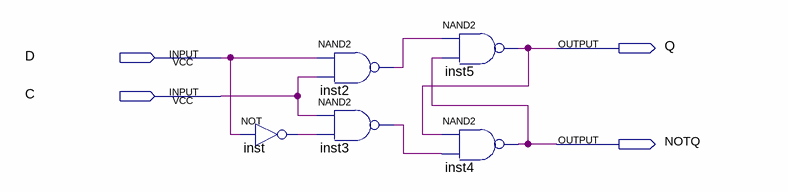
[diagram p0: schematic sheet]
// Quartus schematic DFlip.bdf as structural Verilog: 5 symbols, 4 pins
module DFlip (
  input  D,
  input  C,
  output Q,
  output NOTQ
);

  wire inst2_out, inst3_out, inst_out;

  not inst (inst_out, D);
  nand inst2 (inst2_out, D, C);
  nand inst3 (inst3_out, C, inst_out);
  nand inst5 (Q, inst2_out, NOTQ);
  nand inst4 (NOTQ, Q, inst3_out);
endmodule
